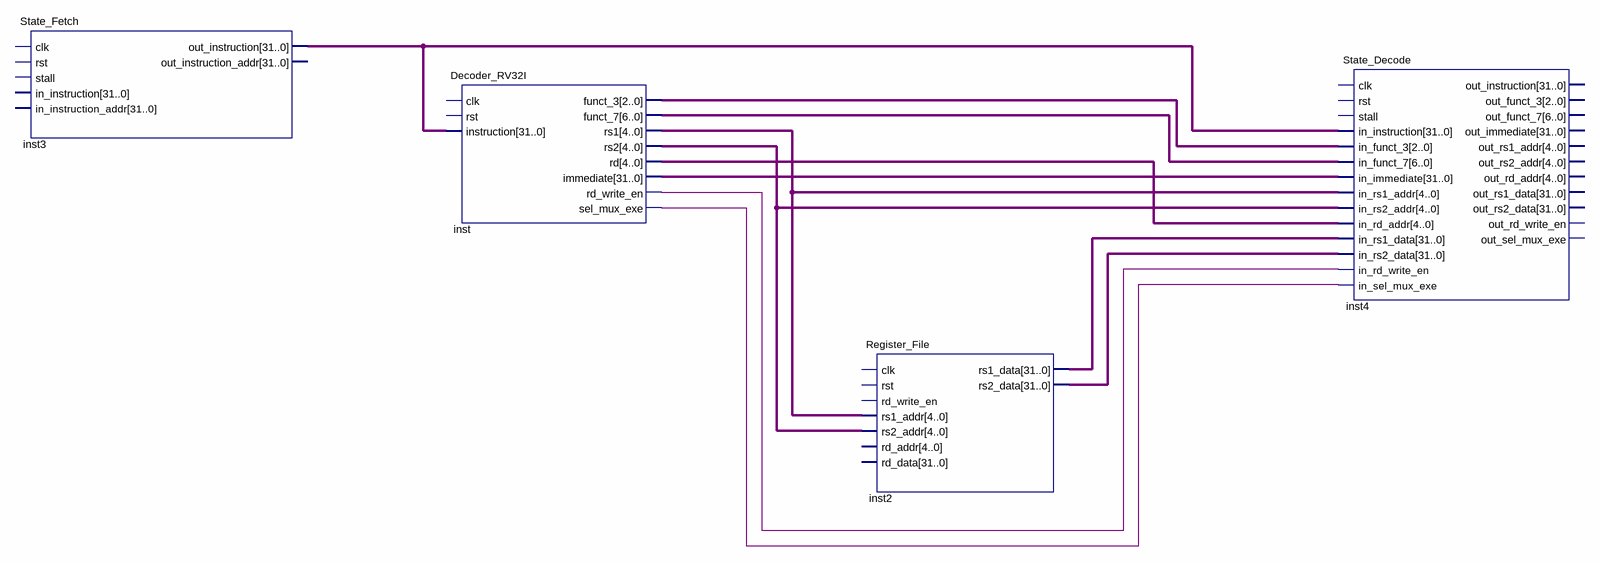
[diagram p0: schematic sheet]
// Quartus schematic Core.bdf as structural Verilog: 4 symbols, 0 pins
module Core (
);

  wire inst_rd_write_en, inst_sel_mux_exe;
  wire [2:0] inst_funct_3;
  wire [4:0] inst_rd, inst_rs1, inst_rs2;
  wire [6:0] inst_funct_7;
  wire [31:0] inst2_rs1_data, inst2_rs2_data, inst3_out_instruction, inst_immediate;

  State_Fetch inst3 (.out_instruction(inst3_out_instruction));  // open: clk, rst, stall, in_instruction, in_instruction_addr, out_instruction_addr
  Decoder_RV32I inst (
    .instruction(inst3_out_instruction), .funct_3(inst_funct_3), .funct_7(inst_funct_7), .rs1(inst_rs1),
    .rs2(inst_rs2), .rd(inst_rd), .immediate(inst_immediate), .rd_write_en(inst_rd_write_en),
    .sel_mux_exe(inst_sel_mux_exe));  // open: clk, rst
  Register_File inst2 (
    .rs1_addr(inst_rs1), .rs2_addr(inst_rs2), .rs1_data(inst2_rs1_data), .rs2_data(inst2_rs2_data));  // open: clk, rst, rd_write_en, rd_addr, rd_data
  State_Decode inst4 (
    .in_instruction(inst3_out_instruction), .in_funct_3(inst_funct_3), .in_funct_7(inst_funct_7),
    .in_immediate(inst_immediate), .in_rs1_addr(inst_rs1), .in_rs2_addr(inst_rs2), .in_rd_addr(inst_rd),
    .in_rs1_data(inst2_rs1_data), .in_rs2_data(inst2_rs2_data), .in_rd_write_en(inst_rd_write_en),
    .in_sel_mux_exe(inst_sel_mux_exe));  // open: clk, rst, stall, out_instruction, out_funct_3, out_funct_7, out_immediate, out_rs1_addr, out_rs2_addr, out_rd_addr, out_rs1_data, out_rs2_data, out_rd_write_en, out_sel_mux_exe
endmodule
